# EAGLE schematic microfloat (EAGLE 9.1.0)

## Sheet 1 of 3: MCU
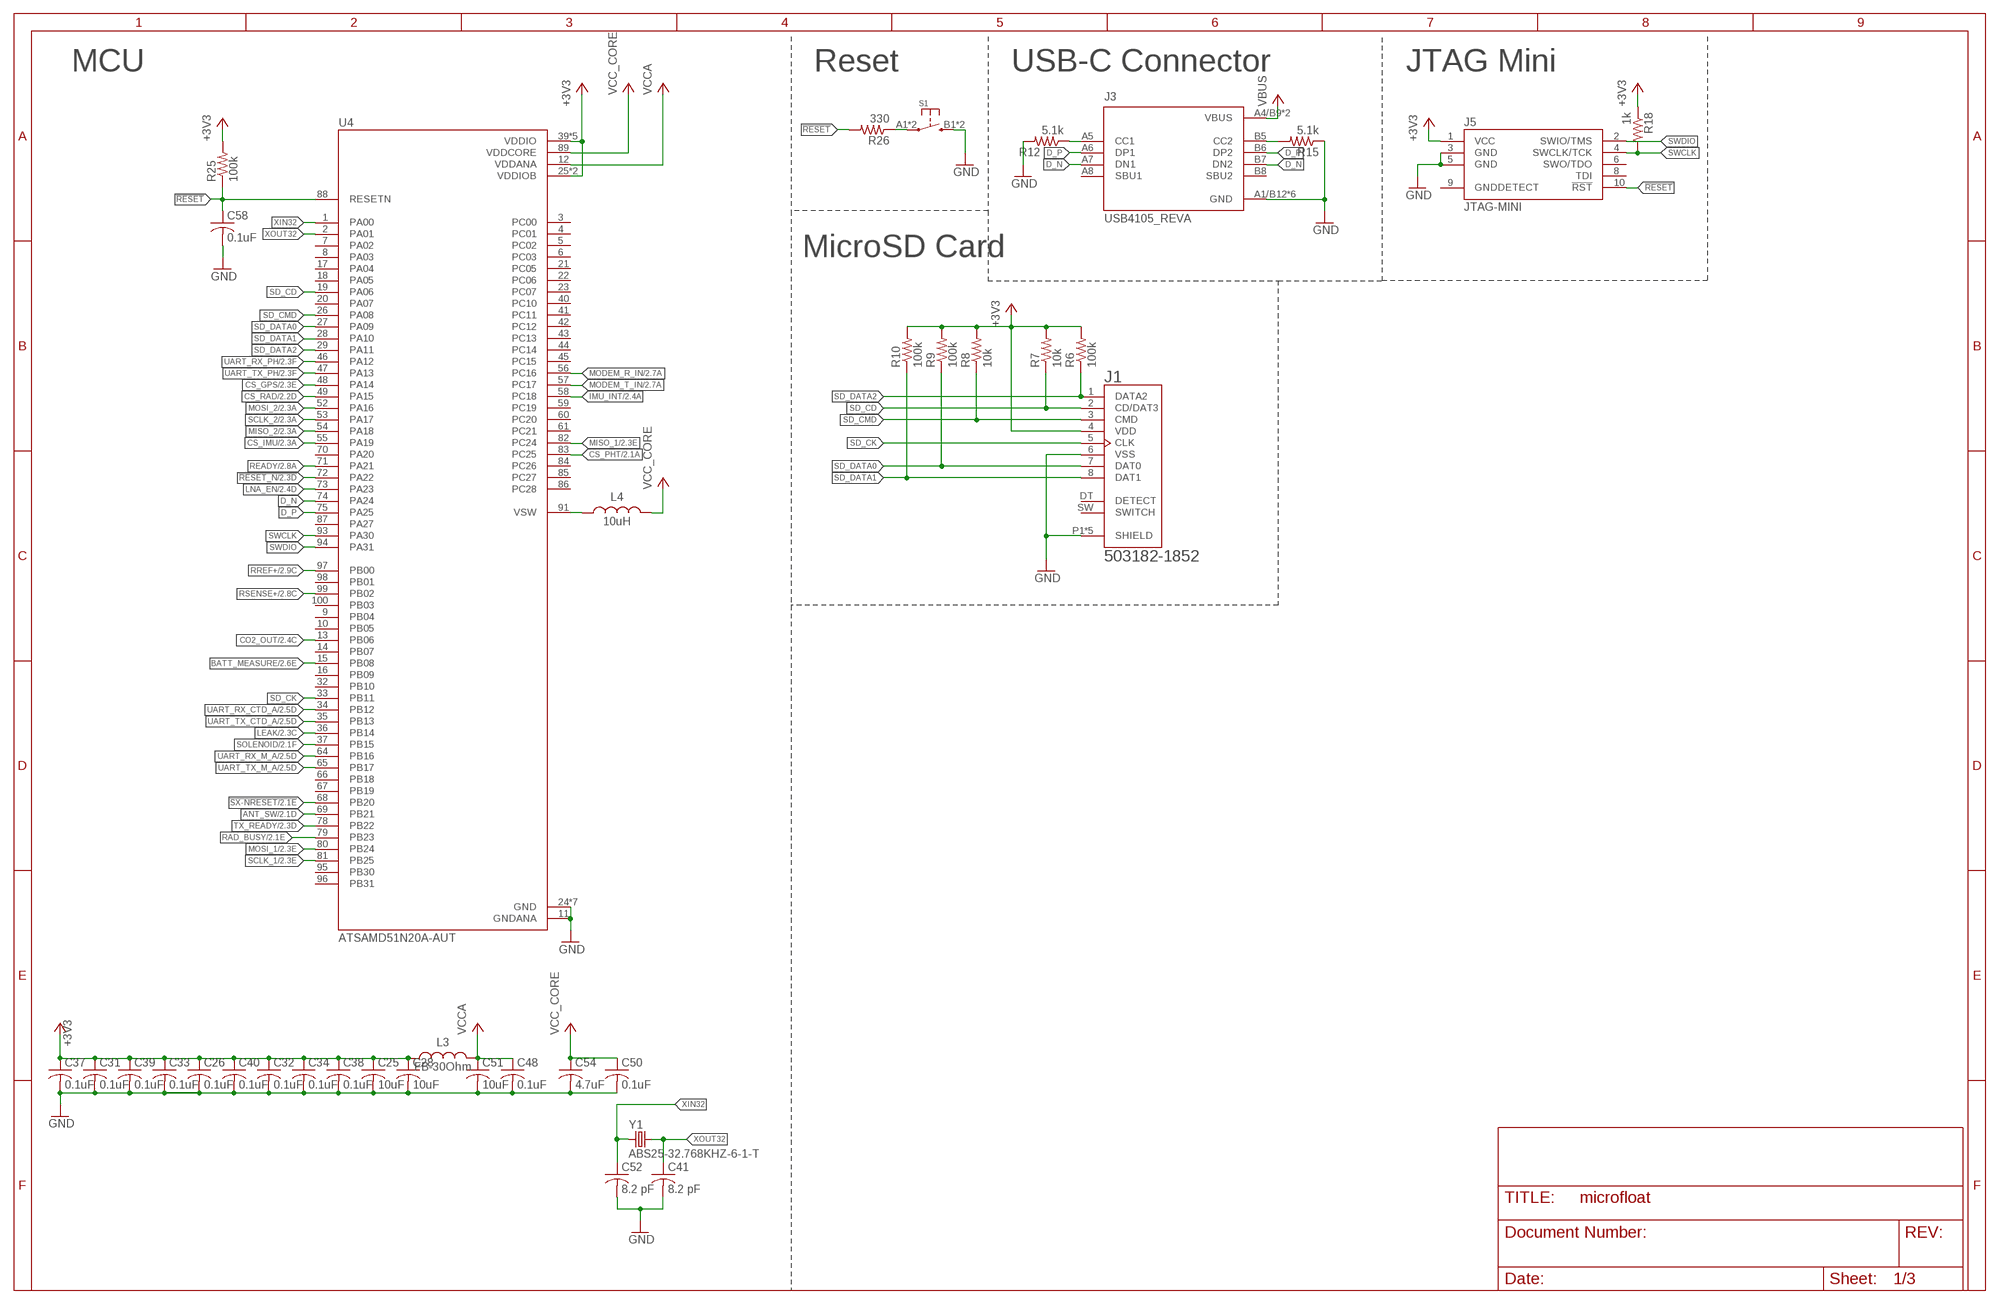
[diagram p0: schematic, sheet 1]

### Parts
C25  10uF  C-USC0805  [C0805]
C26  0.1uF  C-USC0603  [C0603]
C28  10uF  C-USC0805  [C0805]
C31  0.1uF  C-USC0603  [C0603]
C32  0.1uF  C-USC0603  [C0603]
C33  0.1uF  C-USC0603  [C0603]
C34  0.1uF  C-USC0603  [C0603]
C37  0.1uF  C-USC0603  [C0603]
C38  0.1uF  C-USC0603  [C0603]
C39  0.1uF  C-USC0603  [C0603]
C40  0.1uF  C-USC0603  [C0603]
C41  8.2 pF  C-USC0603  [C0603]
C48  0.1uF  C-USC0603  [C0603]
C50  0.1uF  C-USC0603  [C0603]
C51  10uF  C-USC0805  [C0805]
C52  8.2 pF  C-USC0603  [C0603]
C54  4.7uF  C-USC0603  [C0603]
C58  0.1uF  C-USC0603  [C0603]
J1  503182-1852  [MOLEX_503182-1852]
J3  USB4105_REVA  [GCT_USB4105_REVA]
J5  JTAG-MINI  [FTSH-105-01-F-D-K]
L3  FB-30Ohm  INDUCTOR_0805  [0805]
L4  10uH  78438336100  [78438336100]
R6  100k  R-US_R0603  [R0603]
R7  10k  R-US_R0603  [R0603]
R8  10k  R-US_R0603  [R0603]
R9  100k  R-US_R0603  [R0603]
R10  100k  R-US_R0603  [R0603]
R12  5.1k  R-US_R0603  [R0603]
R15  5.1k  R-US_R0603  [R0603]
R18  1k  R-US_R0603  [R0603]
R25  100k  R-US_R0603  [R0603]
R26  330  R-US_R0603  [R0603]
S1  BTN_10-XXSMD  [TACTILE_SWITCH_SMD_6.2MM_TALL]
U4  ATSAMD51N20A-AUT  [QFP50P1600X1600X120-100N]
Y1  ABS25-32.768KHZ-6-1-T  [XTAL_ABS25-32.768KHZ-6-1-T]

### Nets
!RESET: C58.1 J5.10(!RST) R25.1 R26.2 U4.88(RESETN)
!RESET_N: U4.72(PA22) ; also sheet 2
!SX-NRESET: U4.68(PB20) ; also sheet 2
+3V3: C25.1 C26.1 C28.1 C31.1 C32.1 C33.1 C34.1 C37.1 C38.1 C39.1 C40.1 J1.4(VDD) J5.1(VCC) L3.1 R6.2 R7.2 R8.2 R9.2 R10.2 R18.1 R25.2 U4.25(VDDIOB) U4.30(VDDIOB) U4.39(VDDIO) U4.51(VDDIO) U4.63(VDDIO) U4.77(VDDIO) U4.92(VDDIO) ; also sheet 2,3
ANT_SW: U4.69(PB21) ; also sheet 2
BATT_MEASURE: U4.15(PB08) ; also sheet 2
CO2_OUT: U4.13(PB06) ; also sheet 2
CS_GPS: U4.48(PA14) ; also sheet 2
CS_IMU: U4.55(PA19) ; also sheet 2
CS_PHT: U4.83(PC25) ; also sheet 2
CS_RAD: U4.49(PA15) ; also sheet 2
D_N: J3.A7(DN1) J3.B7(DN2) U4.74(PA24)
D_P: J3.A6(DP1) J3.B6(DP2) U4.75(PA25)
GND: C25.2 C26.2 C28.2 C31.2 C32.2 C33.2 C34.2 C37.2 C38.2 C39.2 C40.2 C41.2 C48.2 C50.2 C51.2 C52.2 C54.2 C58.2 J1.6(VSS) J1.P1(SHIELD) J1.P2(SHIELD) J1.P3(SHIELD) J1.P4(SHIELD) J1.P5(SHIELD) J3.A1/B12(GND) J3.B1/A12(GND) J3.G1(GND) J3.G2(GND) J3.G3(GND) J3.G4(GND) J5.3(GND) J5.5(GND) R12.2 R15.1 S1.B1(S) S1.B2(S) U4.11(GNDANA) U4.24(GND) U4.31(GND) U4.38(GND) U4.50(GND) U4.62(GND) U4.76(GND) U4.90(GND) ; also sheet 2,3
IMU_INT: U4.58(PC18) ; also sheet 2
LEAK: U4.36(PB14) ; also sheet 2
LNA_EN: U4.73(PA23) ; also sheet 2
MISO_1: U4.82(PC24) ; also sheet 2
MISO_2: U4.54(PA18) ; also sheet 2
MODEM_R_IN: U4.56(PC16) ; also sheet 2
MODEM_T_IN: U4.57(PC17) ; also sheet 2
MOSI_1: U4.80(PB24) ; also sheet 2
MOSI_2: U4.52(PA16) ; also sheet 2
N$7: J3.B5(CC2) R15.2
N$9: J3.A5(CC1) R12.1
N$25: L4.2 U4.91(VSW)
N$29: R26.1 S1.A1(P) S1.A2(P)
RAD_BUSY: U4.79(PB23) ; also sheet 2
READY: U4.71(PA21) ; also sheet 2
RREF+: U4.97(PB00) ; also sheet 2
RSENSE+: U4.99(PB02) ; also sheet 2
SCLK_1: U4.81(PB25) ; also sheet 2
SCLK_2: U4.53(PA17) ; also sheet 2
SD_CD: J1.2(CD/DAT3) R7.1 U4.19(PA06)
SD_CK: J1.5(CLK) U4.33(PB11)
SD_CMD: J1.3(CMD) R8.1 U4.26(PA08)
SD_DATA0: J1.7(DAT0) R9.1 U4.27(PA09)
SD_DATA1: J1.8(DAT1) R10.1 U4.28(PA10)
SD_DATA2: J1.1(DATA2) R6.1 U4.29(PA11)
SOLENOID: U4.37(PB15) ; also sheet 2
SWCLK: J5.4(SWCLK/TCK) R18.2 U4.93(PA30)
SWDIO: J5.2(SWIO/TMS) U4.94(PA31)
TX_READY: U4.78(PB22) ; also sheet 2
UART_RX_CTD_A: U4.34(PB12) ; also sheet 2
UART_RX_M_A: U4.64(PB16) ; also sheet 2
UART_RX_PH: U4.46(PA12) ; also sheet 2
UART_TX_CTD_A: U4.35(PB13) ; also sheet 2
UART_TX_M_A: U4.65(PB17) ; also sheet 2
UART_TX_PH: U4.47(PA13) ; also sheet 2
VBUS: J3.A4/B9(VBUS) J3.B4/A9(VBUS) ; also sheet 3
VCC_CORE: C50.1 C54.1 L4.1 U4.89(VDDCORE)
VCCA: C48.1 C51.1 L3.2 U4.12(VDDANA)
XIN32: C52.1 U4.1(PA00) Y1.1
XOUT32: C41.1 U4.2(PA01) Y1.4
Unconnected: J1.DT(DETECT) J1.SW(SWITCH) J3.A8(SBU1) J3.B8(SBU2) J5.6(SWO/TDO) J5.8(TDI) J5.9(GNDDETECT) U4.3(PC00) U4.4(PC01) U4.5(PC02) U4.6(PC03) U4.7(PA02) U4.8(PA03) U4.9(PB04) U4.10(PB05) U4.14(PB07) U4.16(PB09) U4.17(PA04) U4.18(PA05) U4.20(PA07) U4.21(PC05) U4.22(PC06) U4.23(PC07) U4.32(PB10) U4.40(PC10) U4.41(PC11) U4.42(PC12) U4.43(PC13) U4.44(PC14) U4.45(PC15) U4.59(PC19) U4.60(PC20) U4.61(PC21) U4.66(PB18) U4.67(PB19) U4.70(PA20) U4.84(PC26) U4.85(PC27) U4.86(PC28) U4.87(PA27) U4.95(PB30) U4.96(PB31) U4.98(PB01) U4.100(PB03)

### Notes on the sheet
- MCU | Reset | USB-C Connector | JTAG Mini
- MicroSD Card

## Sheet 2 of 3: Sensors & Communication
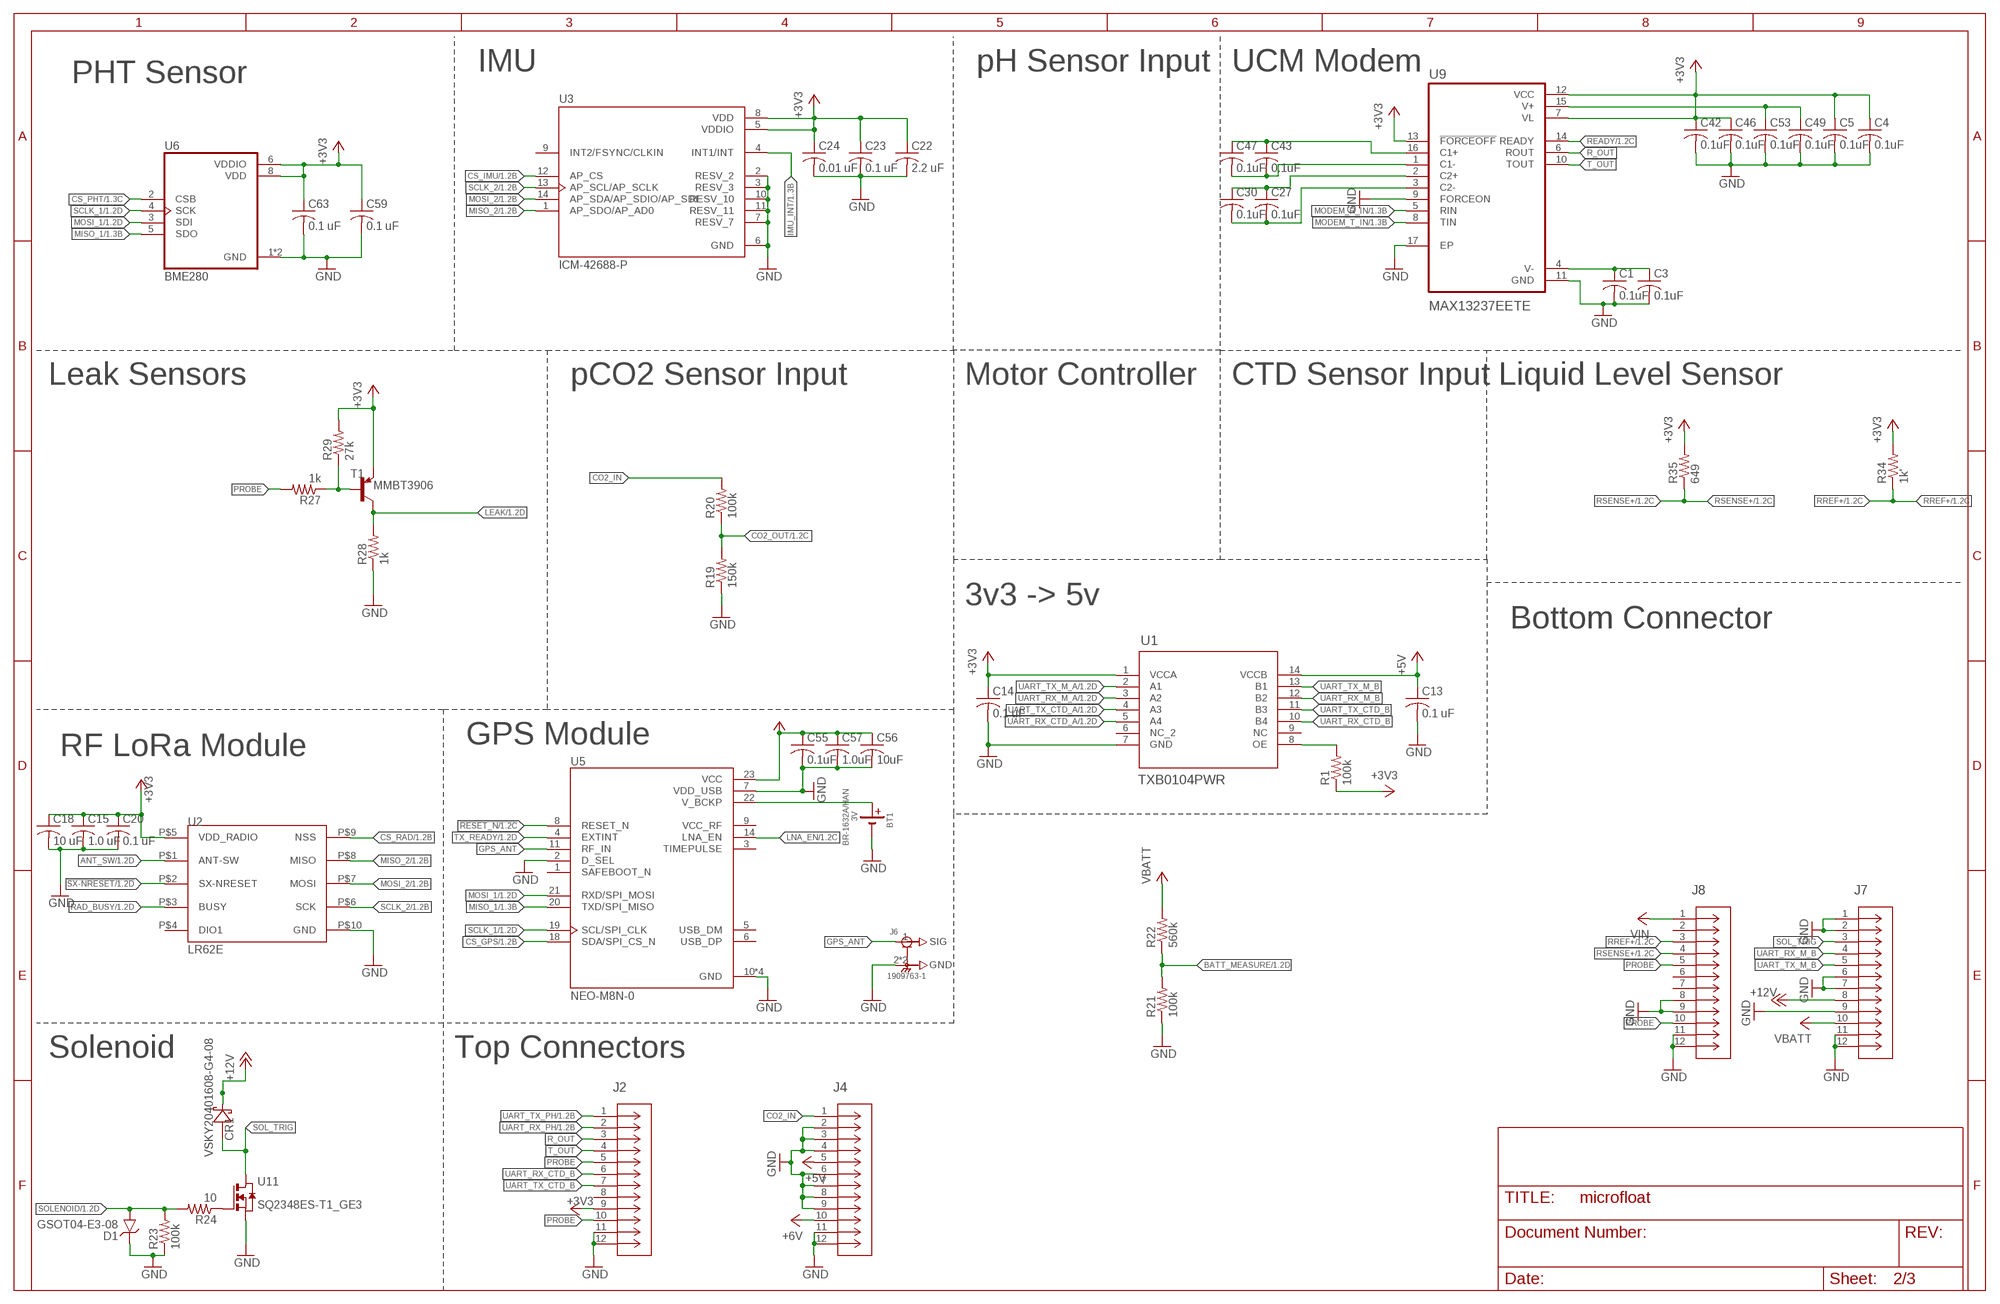
[diagram p1: schematic, sheet 2]

### Parts
BT1  BATTERY  [BR-1632A/HAN]
C1  0.1uF  C-USC0603  [C0603]
C3  0.1uF  C-USC0603  [C0603]
C4  0.1uF  C-USC0603  [C0603]
C5  0.1uF  C-USC0603  [C0603]
C13  0.1 uF  C-USC0603  [C0603]
C14  0.1 uF  C-USC0603  [C0603]
C15  1.0 uF  C-USC0603  [C0603]
C18  10 uF  C-USC0603  [C0603]
C20  0.1 uF  C-USC0603  [C0603]
C22  2.2 uF  C-USC0603  [C0603]
C23  0.1 uF  C-USC0603  [C0603]
C24  0.01 uF  C-USC0603  [C0603]
C27  0.1uF  C-USC0603  [C0603]
C30  0.1uF  C-USC0603  [C0603]
C42  0.1uF  C-USC0603  [C0603]
C43  0.1uF  C-USC0603  [C0603]
C46  0.1uF  C-USC0603  [C0603]
C47  0.1uF  C-USC0603  [C0603]
C49  0.1uF  C-USC0603  [C0603]
C53  0.1uF  C-USC0603  [C0603]
C55  0.1uF  C-USC0603  [C0603]
C56  10uF  C-USC0603  [C0603]
C57  1.0uF  C-USC0603  [C0603]
C59  0.1 uF  C-USC0603  [C0603]
C63  0.1 uF  C-USC0603  [C0603]
CR1  VSKY20401608-G4-08  [CLP1608-2L_VIS]
D1  GSOT04-E3-08  [SOT-23-3]
J2  1054291110  [CON_1054291110_MOL]
J4  1054291110  [CON_1054291110_MOL]
J6  1909763-1  [TE_1909763-1]
J7  1054291110  [CON_1054291110_MOL]
J8  1054291110  [CON_1054291110_MOL]
R1  100k  R-US_R0603  [R0603]
R19  150k  R-US_R0603  [R0603]
R20  100k  R-US_R0603  [R0603]
R21  100k  R-US_R0603  [R0603]
R22  560k  R-US_R0603  [R0603]
R23  100k  R-US_R0603  [R0603]
R24  10  R-US_R0603  [R0603]
R27  1k  R-US_R0603  [R0603]
R28  1k  R-US_R0603  [R0603]
R29  27k  R-US_R0603  [R0603]
R34  1k'  R-US_R0603  [R0603]
R35  649  R-US_R0603  [R0603]
T1  MMBT3906  MMBT3906BC807-40SOT23-BEC  [SOT23-BEC]
U1  TXB0104PWR  [PW14]
U2  LR62E  [LR62E]
U3  ICM-42688-P  [PQFN50P300X250X97-14N]
U5  NEO-M8N-0  [XCVR_NEO-M8N-0]
U6  BME280  [PSON65P250X250X100-8N]
U9  MAX13237EETE  [QFN80P500X500X80-17N]
U11  SQ2348ES-T1_GE3  [SOT-23-3]

### Nets
!RESET_N: U5.8(RESET_N) ; also sheet 1
!SX-NRESET: U2.P$2(SX-NRESET) ; also sheet 1
+3V3: C4.1 C5.1 C14.1 C15.1 C18.1 C20.1 C22.1 C23.1 C24.1 C42.1 C46.1 C55.1 C56.1 C57.1 C59.1 C63.1 J2.9 R1.1 R29.2 R34.2 R35.2 T1.E U1.1(VCCA) U2.P$5(VDD_RADIO) U3.5(VDDIO) U3.8(VDD) U5.23(VCC) U6.6(VDDIO) U6.8(VDD) U9.7(VL) U9.12(VCC) U9.13(!FORCEOFF) ; also sheet 1,3
+5V: C13.1 J4.5 U1.14(VCCB) ; also sheet 3
+6V: J4.10 ; also sheet 3
+12V: CR1.1 J7.8 ; also sheet 3
ANT_SW: U2.P$1(ANT-SW) ; also sheet 1
BATT_MEASURE: R21.2 R22.1 ; also sheet 1
CO2_IN: J4.1 R20.2
CO2_OUT: R19.2 R20.1 ; also sheet 1
CS_GPS: U5.18(SDA/SPI_CS_N) ; also sheet 1
CS_IMU: U3.12(AP_CS) ; also sheet 1
CS_PHT: U6.2(CSB) ; also sheet 1
CS_RAD: U2.P$9(NSS) ; also sheet 1
GND: BT1.-(MINUS) C1.2 C3.2 C4.2 C5.2 C13.2 C14.2 C15.2 C18.2 C20.2 C22.2 C23.2 C24.2 C42.2 C46.2 C49.2 C53.2 C55.2 C56.2 C57.2 C59.2 C63.2 D1.3(C) J2.11 J2.12 J4.2 J4.3 J4.4 J4.6 J4.7 J4.8 J4.9 J4.11 J4.12 J6.2(GND) J6.3(GND) J7.1 J7.2 J7.6 J7.7 J7.9 J7.11 J7.12 J8.8 J8.9 J8.11 J8.12 R19.1 R21.1 R23.1 R28.1 U1.7(GND) U2.P$10(GND) U3.2(RESV_2) U3.3(RESV_3) U3.6(GND) U3.7(RESV_7) U3.10(RESV_10) U3.11(RESV_11) U5.2(D_SEL) U5.7(VDD_USB) U5.10(GND) U5.12(GND) U5.13(GND) U5.24(GND) U6.1(GND) U6.7(GND) U9.9(FORCEON) U9.11(GND) U9.17(EP) U11.2(S) ; also sheet 1,3
GPS_ANT: J6.1(SIG) U5.11(RF_IN)
IMU_INT: U3.4(INT1/INT) ; also sheet 1
LEAK: R28.2 T1.C ; also sheet 1
LNA_EN: U5.14(LNA_EN) ; also sheet 1
MISO_1: U5.20(TXD/SPI_MISO) U6.5(SDO) ; also sheet 1
MISO_2: U2.P$8(MISO) U3.1(AP_SDO/AP_AD0) ; also sheet 1
MODEM_R_IN: U9.5(RIN) ; also sheet 1
MODEM_T_IN: U9.8(TIN) ; also sheet 1
MOSI_1: U5.21(RXD/SPI_MOSI) U6.3(SDI) ; also sheet 1
MOSI_2: U2.P$7(MOSI) U3.14(AP_SDA/AP_SDIO/AP_SDI) ; also sheet 1
N$1: R1.2 U1.8(OE)
N$2: C43.1 C47.1 U9.16(C1+)
N$3: R27.1 R29.1 T1.B
N$4: C43.2 C47.2 U9.1(C1-)
N$5: C27.1 C30.1 U9.2(C2+)
N$6: C27.2 C30.2 U9.3(C2-)
N$8: C1.1 C3.1 U9.4(V-)
N$10: C49.1 C53.1 U9.15(V+)
N$24: R24.1 U11.1(G)
N$32: BT1.+(PLUS) U5.22(V_BCKP)
PROBE: J2.5 J2.10 J8.5 J8.10 R27.2
R_OUT: J2.3 U9.6(ROUT)
RAD_BUSY: U2.P$3(BUSY) ; also sheet 1
READY: U9.14(READY) ; also sheet 1
RREF+: J8.3 R34.1 ; also sheet 1
RSENSE+: J8.4 R35.1 ; also sheet 1
SCLK_1: U5.19(SCL/SPI_CLK) U6.4(SCK) ; also sheet 1
SCLK_2: U2.P$6(SCK) U3.13(AP_SCL/AP_SCLK) ; also sheet 1
SOL_TRIG: CR1.2 J7.3 U11.3(D)
SOLENOID: D1.1(A) R23.2 R24.2 ; also sheet 1
T_OUT: J2.4 U9.10(TOUT)
TX_READY: U5.4(EXTINT) ; also sheet 1
UART_RX_CTD_A: U1.5(A4) ; also sheet 1
UART_RX_CTD_B: J2.6 U1.10(B4)
UART_RX_M_A: U1.3(A2) ; also sheet 1
UART_RX_M_B: J7.4 U1.12(B2)
UART_RX_PH: J2.2 ; also sheet 1
UART_TX_CTD_A: U1.4(A3) ; also sheet 1
UART_TX_CTD_B: J2.7 U1.11(B3)
UART_TX_M_A: U1.2(A1) ; also sheet 1
UART_TX_M_B: J7.5 U1.13(B1)
UART_TX_PH: J2.1 ; also sheet 1
VBATT: J7.10 R22.2 ; also sheet 3
VIN: J8.1 ; also sheet 3
Unconnected: J2.8 J8.2 J8.6 J8.7 U1.6(NC_2) U1.9(NC) U2.P$4(DIO1) U3.9(INT2/FSYNC/CLKIN) U5.1(SAFEBOOT_N) U5.3(TIMEPULSE) U5.5(USB_DM) U5.6(USB_DP) U5.9(VCC_RF)

### Notes on the sheet
- IMU | pH Sensor Input | UCM Modem
- PHT Sensor
- Leak Sensors | pCO2 Sensor Input | Motor Controller | CTD Sensor Input | Liquid Level Sensor
- 3v3 -> 5v
- Bottom Connector
- GPS Module
- RF LoRa Module
- Solenoid | Top Connectors

## Sheet 3 of 3: Power
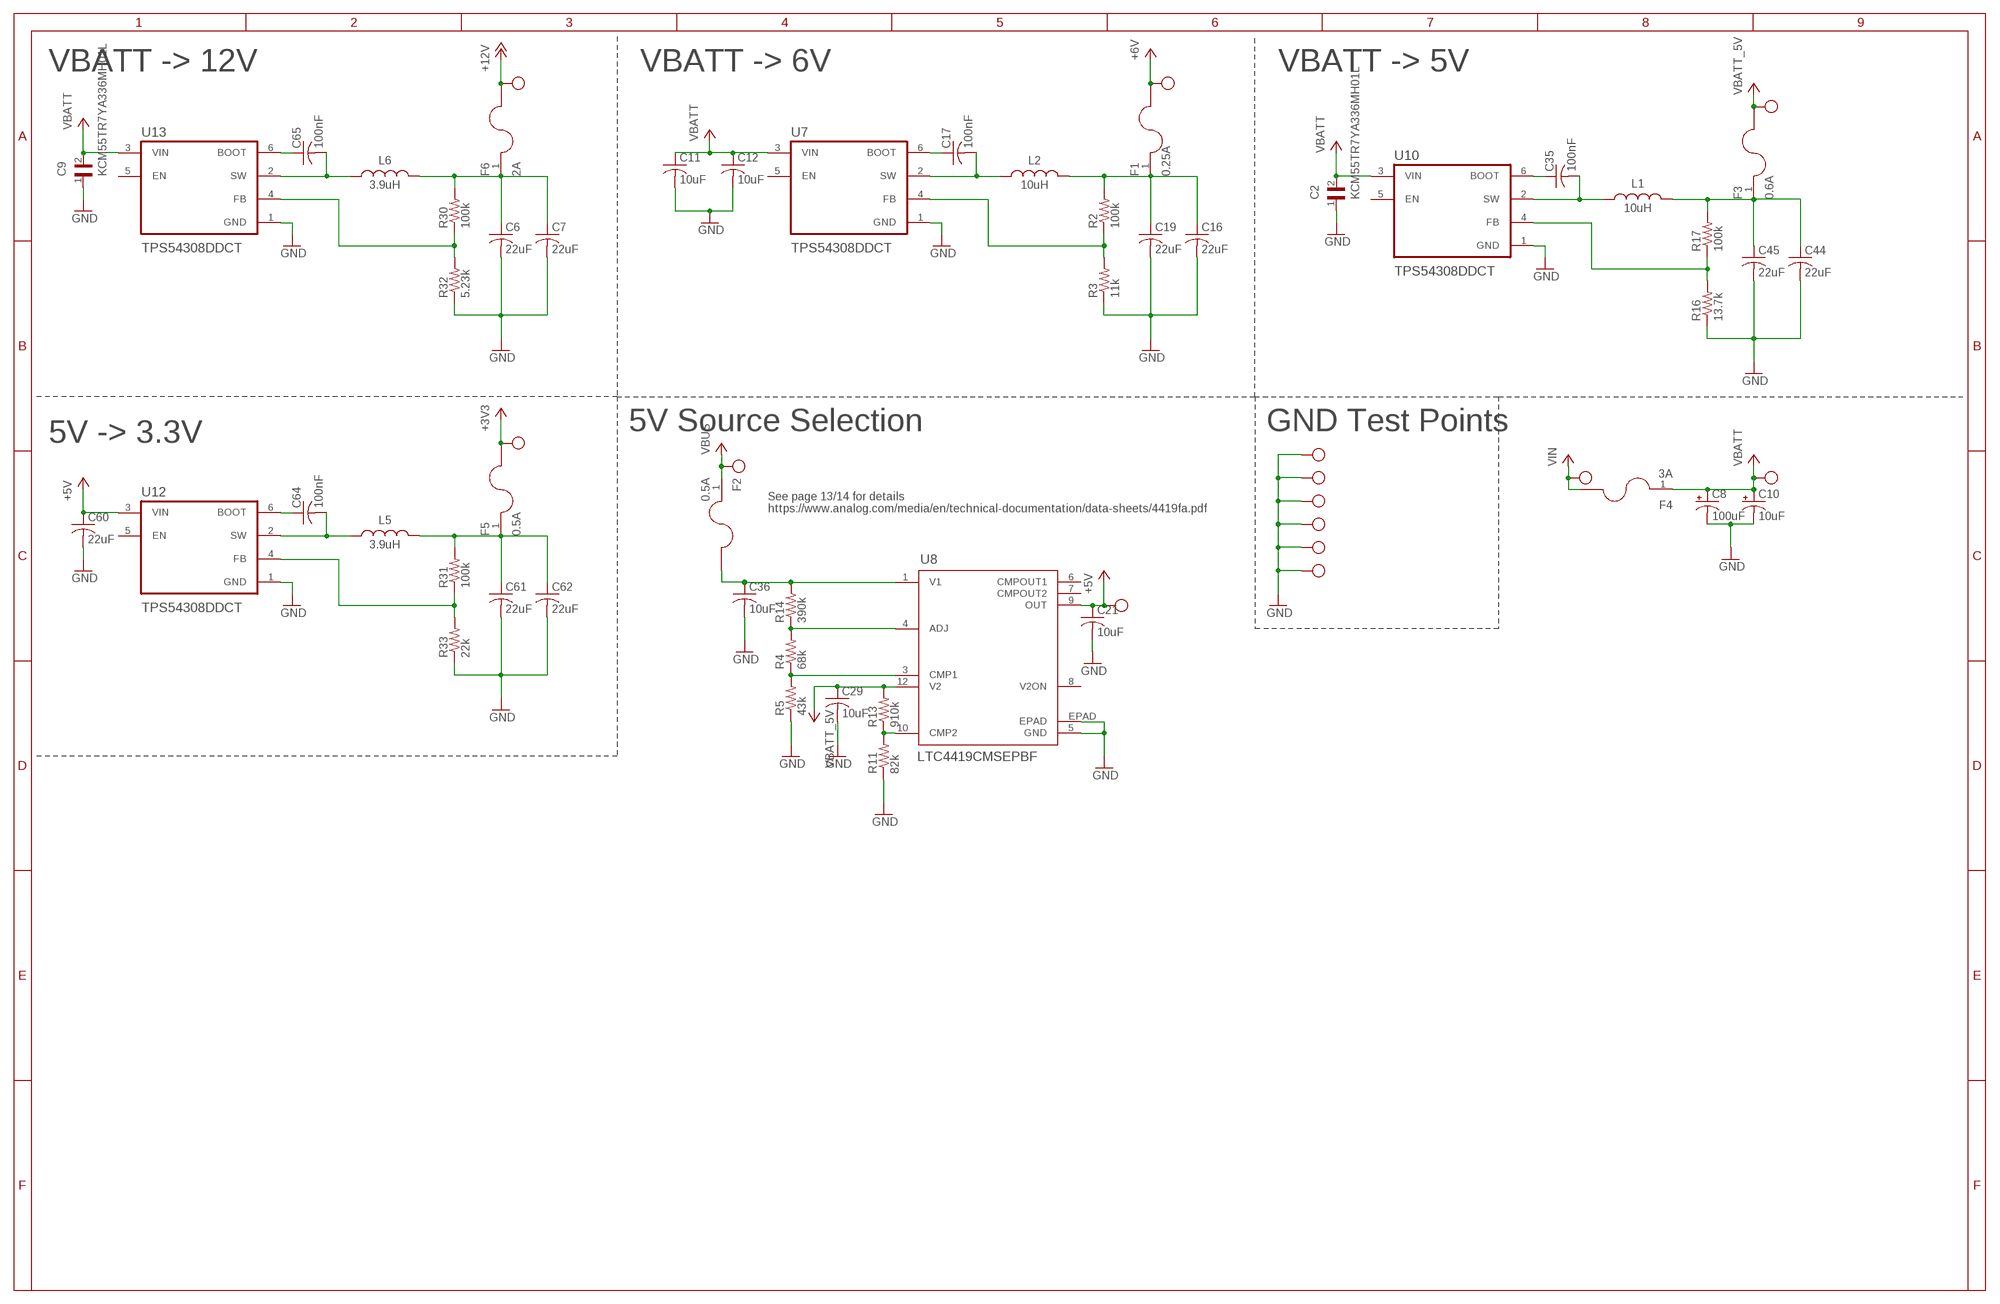
[diagram p2: schematic, sheet 3]

### Parts
$$$$$$U$1  TEST_POINT  [TEST_POINT]
$$$$$$U$2  TEST_POINT  [TEST_POINT]
$$$$$$U$3  TEST_POINT  [TEST_POINT]
$$$$$$U$4  TEST_POINT  [TEST_POINT]
$$$$$$U$5  TEST_POINT  [TEST_POINT]
$$$$$$U$6  TEST_POINT  [TEST_POINT]
$$$$U$2  TEST_POINT  [TEST_POINT]
$$$$U$3  TEST_POINT  [TEST_POINT]
$$$$U$4  TEST_POINT  [TEST_POINT]
$$$$U$5  TEST_POINT  [TEST_POINT]
$$U$1  TEST_POINT  [TEST_POINT]
$$U$2  TEST_POINT  [TEST_POINT]
$$U$3  TEST_POINT  [TEST_POINT]
$$U$5  TEST_POINT  [TEST_POINT]
C2  KCM55TR7YA336MH01L  [CAPC6153X500N]
C6  22uF  C-USC0805  [C0805]
C7  22uF  C-USC0805  [C0805]
C8  100uF  CPOL-USE3.5-8  [E3,5-8]
C9  KCM55TR7YA336MH01L  [CAPC6153X500N]
C10  10uF  CPOL-USE2.5-5  [E2,5-5]
C11  10uF  C-USC0805  [C0805]
C12  10uF  C-USC0805  [C0805]
C16  22uF  C-USC0805  [C0805]
C17  100nF  C-USC0603  [C0603]
C19  22uF  C-USC0805  [C0805]
C21  10uF  C-USC0603  [C0603]
C29  10uF  C-USC0603  [C0603]
C35  100nF  C-USC0603  [C0603]
C36  10uF  C-USC0603  [C0603]
C44  22uF  C-USC0603  [C0603]
C45  22uF  C-USC0603  [C0603]
C60  22uF  C-USC0603  [C0603]
C61  22uF  C-USC0603  [C0603]
C62  22uF  C-USC0603  [C0603]
C64  100nF  C-USC0603  [C0603]
C65  100nF  C-USC0603  [C0603]
F1  0.25A  SMD_FUSE1206  [F1206]
F2  0.5A  SMD_FUSE1206  [F1206]
F3  0.6A  SMD_FUSE1206  [F1206]
F4  3A  SMD_FUSE1206  [F1206]
F5  0.5A  SMD_FUSE1206  [F1206]
F6  2A  SMD_FUSE1206  [F1206]
L1  10uH  78438336100  [78438336100]
L2  10uH  78438336100  [78438336100]
L5  3.9uH  SRR3818A-3R9Y  [SRR3818A-3R9Y]
L6  3.9uH  SRR3818A-3R9Y  [SRR3818A-3R9Y]
R2  100k  R-US_R0603  [R0603]
R3  11k  R-US_R0603  [R0603]
R4  68k  R-US_R0603  [R0603]
R5  43k  R-US_R0603  [R0603]
R11  82k  R-US_R0603  [R0603]
R13  910k  R-US_R0603  [R0603]
R14  390k  R-US_R0603  [R0603]
R16  13.7k  R-US_R0603  [R0603]
R17  100k  R-US_R0603  [R0603]
R30  100k  R-US_R0603  [R0603]
R31  100k  R-US_R0603  [R0603]
R32  5.23k  R-US_R0603  [R0603]
R33  22k  R-US_R0603  [R0603]
U7  TPS54308DDCT  [SOT95P280X110-6N]
U8  LTC4419CMSEPBF  [MSE_12_ADI]
U10  TPS54308DDCT  [SOT95P280X110-6N]
U12  TPS54308DDCT  [SOT95P280X110-6N]
U13  TPS54308DDCT  [SOT95P280X110-6N]

### Nets
+3V3: $$$$U$5.P$1 F5.2 ; also sheet 1,2
+5V: $$$$U$4.P$1 C21.1 C60.1 U8.9(OUT) U12.3(VIN) ; also sheet 2
+6V: $$$$U$3.P$1 F1.2 ; also sheet 2
+12V: $$U$5.P$1 F6.2 ; also sheet 2
GND: $$$$$$U$4.P$1 $$$$$$U$5.P$1 $$$$U$2.P$1 $$U$1.P$1 $$U$2.P$1 $$U$3.P$1 C2.1 C6.2 C7.2 C8.- C9.1 C10.- C11.2 C12.2 C16.2 C19.2 C21.2 C29.2 C36.2 C44.2 C45.2 C60.2 C61.2 C62.2 R3.1 R5.1 R11.1 R16.1 R32.1 R33.1 U7.1(GND) U8.5(GND) U8.EPAD U10.1(GND) U12.1(GND) U13.1(GND) ; also sheet 1,2
N$11: C35.1 U10.6(BOOT)
N$12: C35.2 L1.2 U10.2(SW)
N$13: R16.2 R17.1 U10.4(FB)
N$14: C64.1 U12.6(BOOT)
N$15: C64.2 L5.1 U12.2(SW)
N$16: R31.1 R33.2 U12.4(FB)
N$17: C6.1 C7.1 F6.1 L6.2 R30.2
N$18: C16.1 C19.1 F1.1 L2.1 R2.2
N$19: C44.1 C45.1 F3.1 L1.1 R17.2
N$20: C61.1 C62.1 F5.1 L5.2 R31.2
N$21: R4.2 R14.1 U8.4(ADJ)
N$22: R4.1 R5.2 U8.3(CMP1)
N$23: R11.2 R13.1 U8.10(CMP2)
N$26: C36.1 F2.2 R14.2 U8.1(V1)
N$35: C65.1 U13.6(BOOT)
N$36: C65.2 L6.1 U13.2(SW)
N$37: R30.1 R32.2 U13.4(FB)
N$38: C17.1 U7.6(BOOT)
N$39: C17.2 L2.2 U7.2(SW)
N$40: R2.1 R3.2 U7.4(FB)
VBATT: $$$$$$U$3.P$1 C2.2 C8.+ C9.2 C10.+ C11.1 C12.1 F4.1 U7.3(VIN) U10.3(VIN) U13.3(VIN) ; also sheet 2
VBATT_5V: $$$$$$U$2.P$1 C29.1 F3.2 R13.2 U8.12(V2)
VBUS: $$$$$$U$1.P$1 F2.1 ; also sheet 1
VIN: $$$$$$U$6.P$1 F4.2 ; also sheet 2
Unconnected: U7.5(EN) U8.6(CMPOUT1) U8.7(CMPOUT2) U8.8(V2ON) U10.5(EN) U12.5(EN) U13.5(EN)

### Notes on the sheet
- VBATT -> 12V | VBATT -> 6V | VBATT -> 5V
- 5V Source Selection | GND Test Points
- 5V -> 3.3V
- See page 13/14 for details
  https://www.analog.com/media/en/technical-documentation/data-sheets/4419fa.pdf

## Library data of the parts
$$$$$$U$1-$$$$$$U$6 $$$$U$2-$$$$U$5 $$U$1-$$U$3 $$U$5 = microfloat:TEST_POINT: Keystone Electronics Test Point 5005
BT1 = microfloat:BATTERY: Battery BR1632A/HAN <https://www.mouser.com/datasheet/2/315/panasonic-lithium-coin-hightemp-br1632a-datasheet-876746.pdf>; DKPN: P023-ND; MANUFACTURER: Panasonic - BSG; MOPN: 658-BR1632A/HAN; MPN: BR-1632A/HAN; VOLTAGE: 3V
C1 C3-C5 C13-C15 C18 C20-C34 C36-C40 C42-C51 C53-C64 = rcl:C-US: CAPACITOR, American symbol; SPICEPREFIX: C; TOLERANCE: 5%; VOLTAGE: 10V
C2 C9 = microfloat:KCM55TR7YA336MH01L: CAP CERAMIC 33UF 35V X7R 20% SMD; DESCRIPTION: SMD Capacitor X7R(EIA) with Capacitance: 33uF Tol. 20%. Rated Voltage: 35Vdc; DIGI-KEY_PART_NUMBER: 490-16299-1-ND; MF: Murata; MP: KCM55TR7YA336MH01L; PACKAGE: 6153 Murata; PURCHASE-URL: https://pricing.snapeda.com/search/part/KCM55TR7YA336MH01L/?ref=eda
C6 C7 C16 C17 C19 C35 C65 = rcl:C-US: CAPACITOR, American symbol; SPICEPREFIX: C; TOLERANCE: 5%; VOLTAGE: 16V
C8 C10 = rcl:CPOL-US: POLARIZED CAPACITOR, American symbol; SPICEPREFIX: C; TOLERANCE: 20%; VOLTAGE: 25V
C11 C12 = rcl:C-US: CAPACITOR, American symbol; SPICEPREFIX: C; TOLERANCE: 5%; VOLTAGE: 35V
C41 C52 = rcl:C-US: CAPACITOR, American symbol; SPICEPREFIX: C; TOLERANCE: 0.5%; VOLTAGE: 10V
CR1 = microfloat:VSKY20401608-G4-08; BUILT_BY: EMA_Cory; COPYRIGHT: Copyright (C) 2018 Accelerated Designs. All rights reserved; DATASHEET: https://www.vishay.com/docs/85892/vsky20401608.pdf; MANUFACTURER_PART_NUMBER: VSKY20401608-G4-08; SOURCELIBRARY: Vishay_2020-06-02; VENDOR: Vishay
D1 = microfloat:GSOT04-E3-08
F1-F6 = microfloat:SMD_FUSE: Generic part for SMD fuses
J1 = microfloat:503182-1852: Conn Micro SD Card M 8 POS 1.09mm Solder RA SMD Embossed T/R 0.5A/Contact; DESCRIPTION: 10 (8 + 2) Position Card Connector Secure Digital - microSD™ Surface Mount, Right Angle Gold; DKPN: WM12834CT-ND
J2 J4 J7 J8 = microfloat:1054291110; BUILT_BY: Molex_Team; COPYRIGHT: Copyright (C) 2018 Accelerated Designs. All rights reserved; MANUFACTURER_PART_NUMBER: 1054291110; SOURCELIBRARY: Add_to_database_2021-02-05; VENDOR: Molex Connector Corporation
J3 = microfloat:USB4105_REVA: USB Type C Receptacle for USB 2.0 SMT Type, PCB Top Mount; DESCRIPTION: USB-C (USB TYPE-C) USB 2.0 Receptacle Connector 24 (16+8 Dummy) Position Surface Mount, Right Angle; Through Hole; MF: Global Connector Technology; MP: USB4105; PACKAGE: Package
J5 = microfloat:JTAG-MINI
J6 = microfloat:1909763-1: VAO ITEM, MINI RF HEADER
L1 L2 L4 = microfloat:78438336100; TOLERANCE: 10%
L3 = RoboJackets-Inductors:INDUCTOR_0805: Generic 0805 Inductor; DKPN: 490-1035-1-ND; TOLERANCE: 25%
L5 L6 = microfloat:SRR3818A-3R9Y; TOLERANCE: 10%
R1-R3 R6-R10 R16-R18 R23-R33 = rcl:R-US_: RESISTOR, American symbol; SPICEPREFIX: R; TOLERANCE: 1%
R4 R5 R11-R15 R19-R22 R34 R35 = rcl:R-US_: RESISTOR, American symbol; SPICEPREFIX: R; TOLERANCE: 0.1%
S1 = microfloat:BTN_10-XX: Small momentary tactile push button
T1 = microfloat:MMBT3906: PNP Transistror
U1 = microfloat:TXB0104PWR; DATASHEET_URL: http://www.ti.com/lit/gpn/TXB0104; DESCRIPTION: 4-Bit Bidirectional Voltage-Level Translator with Auto Direction Sensing and +/-15 kV ESD Protect; MANUFACTURER_PART_NUMBER: TXB0104PWR
U2 = microfloat:LR62E; DKPN: 1914-LR62ECT-ND
U3 = microfloat:ICM-42688-P: Accelerometer, Gyroscope, 6 Axis Sensor Output; DESCRIPTION: Accelerometer, Gyroscope, 6 Axis Sensor Output; DKPN: 1428-ICM-42688-PCT-ND
U4 = microfloat:ATSAMD51N20A-AUT: 120MHZ 1024KB FLASH 100 TQFP PKG Check prices <https://pricing.snapeda.com/parts/ATSAMD51N20A-AU/Microchip/view-part?ref=eda>; AVAILABILITY: Warning; DESCRIPTION: ARM® Cortex®-M4F SAM D51 Microcontroller IC 32-Bit 120MHz 1MB (1M x 8) FLASH 100-TQFP (14x14); MF: Microchip; MP: ATSAMD51N20A-AU; PACKAGE: TQFP-100 Microchip; PRICE: None; PURCHASE-URL: https://pricing.snapeda.com/search/part/ATSAMD51N20A-AU/?ref=eda
U5 = microfloat:NEO-M8N-0: Ic Receiver Gps/Gnss 24lcc; DESCRIPTION: NEO-M8 RF Receiver BeiDou, Galileo, GLONASS, GNSS, GPS 1.575GHz -167dBm; DKPN: 672-NEO-M8N-0CT-ND
U6 = microfloat:BME280: DIGITAL HUMIDITY, PRESSURE AND TEMPERATURE SENSOR * Digital interface I²C (up to 3.4 MHz) and SPI (3 and 4 wire, up to 10 MHz)* Supply voltage VDD main supply voltage range: 1.71 V to 3.6 V*VDDIO interface voltage range: 1.2 V to 3.6 V Operating range -40…+85 °C, 0…100 % rel. humidity, 300…1100 hPa The library has been designed by Richard Magdycz <https://www.facebook.com/groups/eaglecadsoftUK>; DESCRIPTION: BME280 - Humidity, Pressure, Temperature Sensor Evaluation Board; DKPN: 828-1049-ND
U7 U10 U12 U13 = microfloat:TPS54308DDCT; DESCRIPTION: 4.5V to 28V Input, 3A Output, Synchronous 350kHz FCCM Step-Down Converter 6-SOT-23-THIN -40 to 125; DIGI-KEY_PART_NUMBER: 296-47881-1-ND; MF: Texas Instruments; MP: TPS54308DDCT; PACKAGE: SOT-23-THN-6 Texas Instruments; PURCHASE-URL: https://pricing.snapeda.com/search/part/TPS54308DDCT/?ref=eda
U8 = microfloat:LTC4419CMSEPBF; BUILT_BY: EMA_Jessica; COPYRIGHT: Copyright (C) 2016 Accelerated Designs. All rights reserved; MANUFACTURER_PART_NUMBER: LTC4419CMSE#PBF; SOURCELIBRARY: Analog_Devices_2018-09-28; VENDOR: Analog Devices Inc
U9 = microfloat:MAX13237EETE; DESCRIPTION: 1/1 Transceiver Full RS232 16-TQFN (5x5); DIGI-KEY_PART_NUMBER: MAX13237EETE+TTR-ND; MF: Maxim Integrated; MP: MAX13237EETE; PACKAGE: WQFN-16 Maxim Integrated
U11 = microfloat:SQ2348ES-T1_GE3
Y1 = microfloat:ABS25-32.768KHZ-6-1-T: ABS25 Series 32.768 kHz ±10 ppm 6 pF -40 to +85 °C SMT Low Frequency Crystal; DESCRIPTION: 32.768kHz ±10ppm Crystal 6pF 50 kOhms 4-SOJ, 5.50mm pitch; DIGI-KEY_PART_NUMBER: 535-10241-1-ND; MF: Abracon; MP: ABS25-32.768KHZ-6-1-T; PACKAGE: 4-4 Abracon; PURCHASE-URL: https://pricing.snapeda.com/search/part/ABS25-32.768KHZ-6-1-T/?ref=eda